# EAGLE design MotorController (EAGLE 5.04)
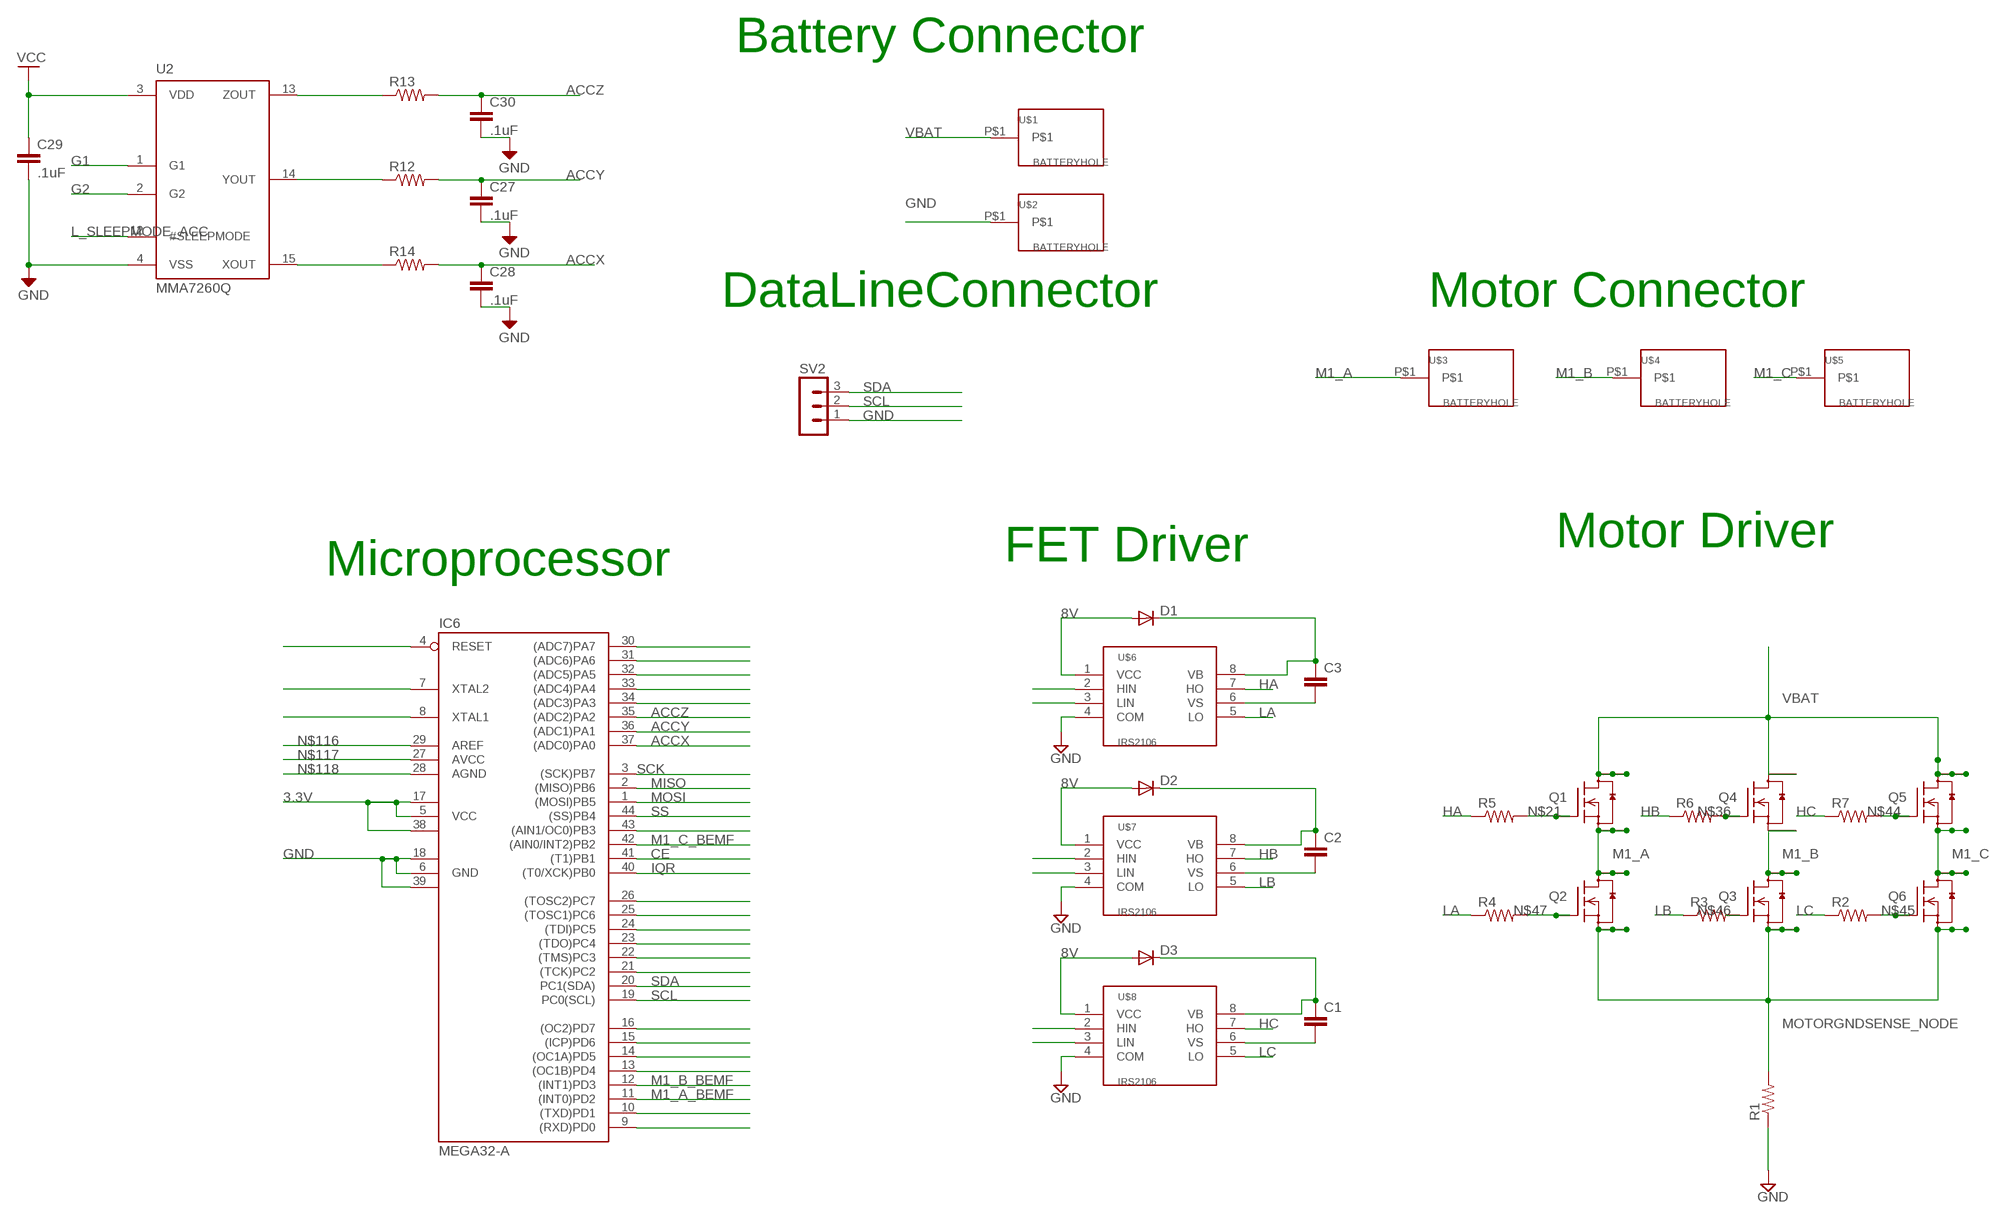
[diagram p0: schematic, sheet 1, part 1 of 2]
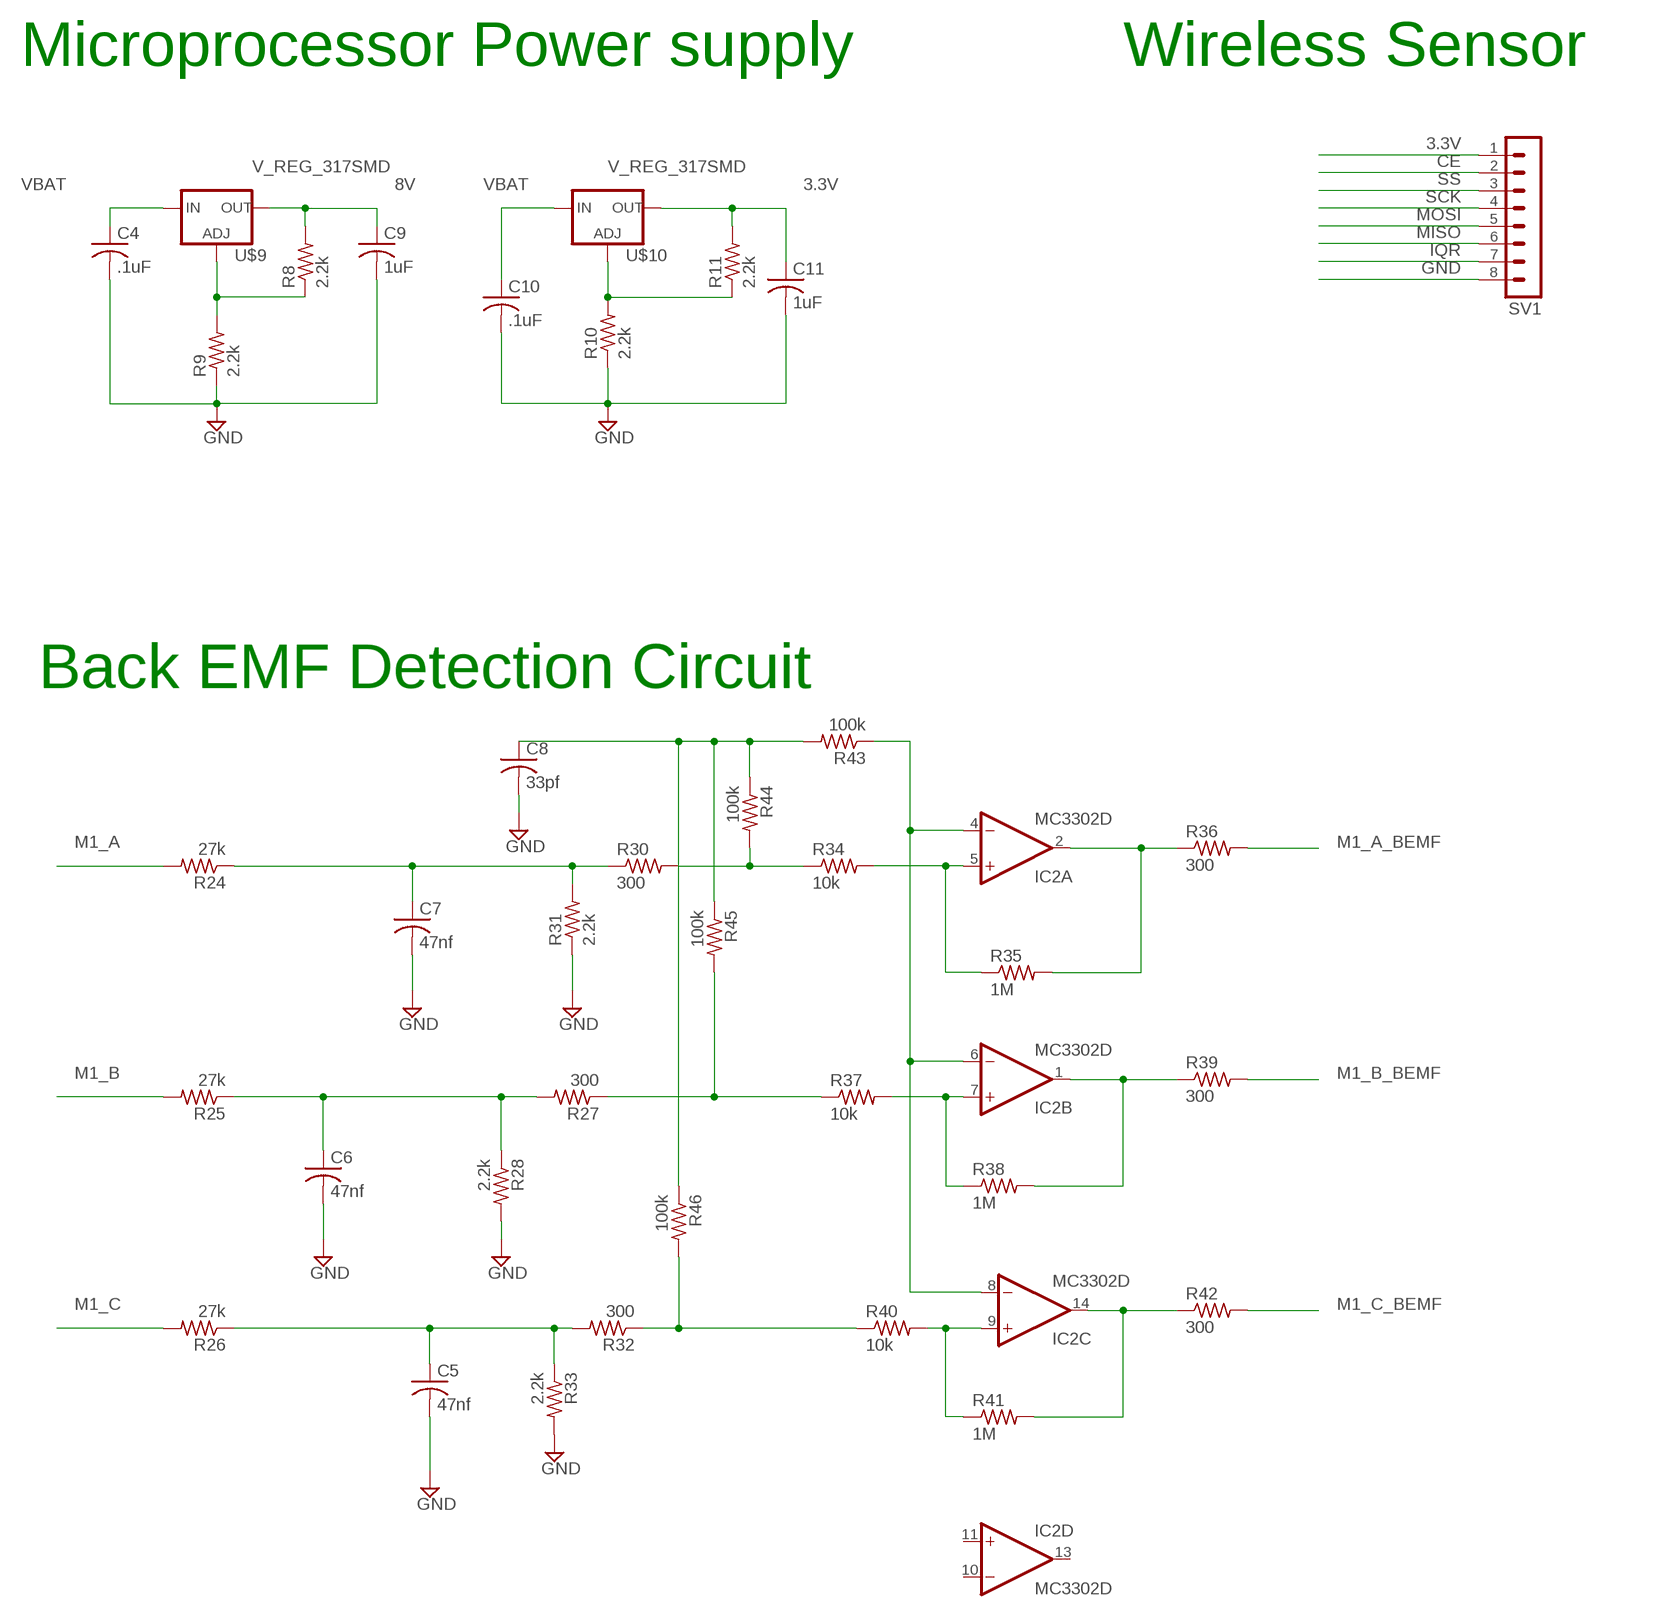
[diagram p1: schematic, sheet 1, part 2 of 2]

## Parts
C1  C-EUC0805  [C0805]
C2  C-EUC0805  [C0805]
C3  C-EUC0805  [C0805]
C4  .1uF  C-USC1206  [C1206@1]
C5  47nf  C-USC0603  [C0603@1]
C6  47nf  C-USC0603  [C0603@1]
C7  47nf  C-USC0603  [C0603@1]
C8  33pf  C-USC0603  [C0603@1]
C9  1uF  C-USC1206  [C1206@1]
C10  .1uF  C-USC1206  [C1206@1]
C11  1uF  C-USC1206  [C1206@1]
C27  .1uF  C-EUC0402  [C0402]
C28  .1uF  C-EUC0402  [C0402]
C29  .1uF  C-EUC0402  [C0402]
C30  .1uF  C-EUC0402  [C0402]
D1  DIODE-DO214AA  [DO214AA]
D2  DIODE-DO214AA  [DO214AA]
D3  DIODE-DO214AA  [DO214AA]
IC2  MC3302D  [SO14]
IC6  MEGA32-A  [TQFP44]
Q1  SI7868ADP  [SO-8-POWERPAK]
Q2  SI7868ADP  [SO-8-POWERPAK]
Q3  SI7868ADP  [SO-8-POWERPAK]
Q4  SI7868ADP  [SO-8-POWERPAK]
Q5  SI7868ADP  [SO-8-POWERPAK]
Q6  SI7868ADP  [SO-8-POWERPAK]
R1  R-US_R2512  [R2512]
R2  R-US_R1206  [R1206]
R3  R-US_R1206  [R1206]
R4  R-US_R1206  [R1206]
R5  R-US_R1206  [R1206]
R6  R-US_R1206  [R1206]
R7  R-US_R1206  [R1206]
R8  2.2k  R-US_R0603  [R0603]
R9  2.2k  R-US_R0603  [R0603]
R10  2.2k  R-US_R0603  [R0603]
R11  2.2k  R-US_R0603  [R0603]
R12  R-US_R0402  [R0402]
R13  R-US_R0402  [R0402]
R14  R-US_R0402  [R0402]
R24  27k  R-US_R0603  [R0603]
R25  27k  R-US_R0603  [R0603]
R26  27k  R-US_R0603  [R0603]
R27  300  R-US_R0603  [R0603]
R28  2.2k  R-US_R0603  [R0603]
R30  300  R-US_R0603  [R0603]
R31  2.2k  R-US_R0603  [R0603]
R32  300  R-US_R0603  [R0603]
R33  2.2k  R-US_R0603  [R0603]
R34  10k  R-US_R0603  [R0603]
R35  1M  R-US_R0603  [R0603]
R36  300  R-US_R0603  [R0603]
R37  10k  R-US_R0603  [R0603]
R38  1M  R-US_R0603  [R0603]
R39  300  R-US_R0603  [R0603]
R40  10k  R-US_R0603  [R0603]
R41  1M  R-US_R0603  [R0603]
R42  300  R-US_R0603  [R0603]
R43  100k  R-US_R0603  [R0603]
R44  100k  R-US_R0603  [R0603]
R45  100k  R-US_R0603  [R0603]
R46  100k  R-US_R0603  [R0603]
SV1  MA08-1  [MA08-1]
SV2  MA03-1  [MA03-1]
U2  MMA7260Q  [QFN-16]
U$1  BATTERYHOLE  [BATTERYHOLE]
U$2  BATTERYHOLE  [BATTERYHOLE]
U$3  BATTERYHOLE  [BATTERYHOLE]
U$4  BATTERYHOLE  [BATTERYHOLE]
U$5  BATTERYHOLE  [BATTERYHOLE]
U$6  IRS2106  [SOIC8]
U$7  IRS2106  [SOIC8]
U$8  IRS2106  [SOIC8]
U$9  V_REG_317SMD  [SOT223]
U$10  V_REG_317SMD  [SOT223]

## Nets
3.3V: C11.1 IC6.5(VCC) IC6.17(VCC1) IC6.38(VCC2) R11.2 SV1.1 U$10.2(OUT)
8V: C9.1 D1.A D2.A D3.A R8.2 U$6.1(VCC) U$7.1(VCC) U$8.1(VCC) U$9.2(OUT)
ACCX: C28.1 IC6.37((ADC0)PA0) R14.2
ACCY: C27.1 IC6.36((ADC1)PA1) R12.2
ACCZ: C30.1 IC6.35((ADC2)PA2) R13.2
CE: IC6.41((T1)PB1) SV1.2
G1: U2.1(G1)
G2: U2.2(G2)
GND: C4.2 C5.2 C6.2 C7.2 C8.2 C9.2 C10.2 C11.2 C27.2 C28.2 C29.2 C30.2 IC6.6(GND) IC6.18(GND1) IC6.39(GND2) R1.1 R9.1 R10.1 R28.2 R31.1 R33.2 SV1.8 SV2.1 U2.4(VSS) U$2.P$1 U$6.4(COM) U$7.4(COM) U$8.4(COM)
HA: R5.1 U$6.7(HO)
HB: R6.1 U$7.7(HO)
HC: R7.1 U$8.7(HO)
IQR: IC6.40((T0/XCK)PB0) SV1.7
L_SLEEPMODE_ACC: U2.12(#SLEEPMODE)
LA: R4.1 U$6.5(LO)
LB: R3.1 U$7.5(LO)
LC: R2.1 U$8.5(LO)
M1_A: Q1.1(S) Q1.2(S) Q1.3(S) Q2.6(D) Q2.7(D) Q2.8(D) R24.2 U$3.P$1
M1_A_BEMF: IC6.11((INT0)PD2) R36.2
M1_B: Q3.6(D) Q3.7(D) Q3.8(D) Q4.1(S) Q4.3(S) R25.2 U$4.P$1
M1_B_BEMF: IC6.12((INT1)PD3) R39.2
M1_C: Q5.1(S) Q5.2(S) Q5.3(S) Q6.6(D) Q6.7(D) Q6.8(D) R26.2 U$5.P$1
M1_C_BEMF: IC6.42((AIN0/INT2)PB2) R42.2
MISO: IC6.2((MISO)PB6) SV1.6
MOSI: IC6.1((MOSI)PB5) SV1.5
MOTORGNDSENSE_NODE: Q2.1(S) Q2.2(S) Q2.3(S) Q3.1(S) Q3.2(S) Q3.3(S) Q6.1(S) Q6.2(S) Q6.3(S) R1.2
N$1: C3.1 D1.C U$6.8(VB)
N$2: C3.2 U$6.6(VS)
N$5: C1.2 U$8.6(VS)
N$6: C6.1 R25.1 R27.2 R28.1
N$7: C1.1 D3.C U$8.8(VB)
N$8: C2.1 D2.C U$7.8(VB)
N$9: C2.2 U$7.6(VS)
N$10: R8.1 R9.2 U$9.1(ADJ)
N$11: U$8.2(HIN)
N$12: U$8.3(LIN)
N$13: U$7.2(HIN)
N$17: U$7.3(LIN)
N$18: U$6.2(HIN)
N$19: U$6.3(LIN)
N$21: Q1.4(G) R5.2
N$24: C7.1 R24.1 R30.1 R31.2
N$29: R30.2 R34.1 R44.2
N$30: IC2.4(A:-IN) IC2.6(B:-IN) IC2.8(C:-IN) R43.1
N$31: IC2.5(A:+IN) R34.2 R35.1
N$32: R10.2 R11.1 U$10.1(ADJ)
N$33: C8.1 R43.2 R44.1 R45.1 R46.1
N$34: IC2.7(B:+IN) R37.2 R38.1
N$35: R27.1 R37.1 R45.2
N$36: Q4.4(G) R6.2
N$37: IC2.9(C:+IN) R40.2 R41.1
N$38: R32.1 R40.1 R46.2
N$39: C5.1 R26.1 R32.2
N$40: R33.1
N$41: IC2.14(C:OUT) R41.2 R42.1
N$42: IC2.1(B:OUT) R38.2 R39.1
N$43: IC2.2(A:OUT) R35.2 R36.1
N$44: Q5.4(G) R7.2
N$45: Q6.4(G) R2.2
N$46: Q3.4(G) R3.2
N$47: Q2.4(G) R4.2
N$49: R13.1 U2.13(ZOUT)
N$50: R12.1 U2.14(YOUT)
N$51: R14.1 U2.15(XOUT)
N$113: IC6.4(RESET)
N$114: IC6.7(XTAL2)
N$115: IC6.8(XTAL1)
N$116: IC6.29(AREF)
N$117: IC6.27(AVCC)
N$118: IC6.28(AGND)
N$119: IC6.30((ADC7)PA7)
N$120: IC6.31((ADC6)PA6)
N$121: IC6.32((ADC5)PA5)
N$122: IC6.10((TXD)PD1)
N$123: IC6.9((RXD)PD0)
N$126: IC6.13((OC1B)PD4)
N$127: IC6.14((OC1A)PD5)
N$128: IC6.16((OC2)PD7)
N$129: IC6.15((ICP)PD6)
N$132: IC6.33((ADC4)PA4)
N$133: IC6.34((ADC3)PA3)
N$141: IC6.43((AIN1/OC0)PB3)
N$145: IC6.26((TOSC2)PC7)
N$146: IC6.25((TOSC1)PC6)
N$147: IC6.24((TDI)PC5)
N$148: IC6.23((TDO)PC4)
N$149: IC6.22((TMS)PC3)
N$150: IC6.21((TCK)PC2)
SCK: IC6.3((SCK)PB7) SV1.4
SCL: IC6.19(PC0(SCL)) SV2.2
SDA: IC6.20(PC1(SDA)) SV2.3
SS: IC6.44((SS)PB4) SV1.3
VBAT: C4.1 C10.1 Q1.6(D) Q1.7(D) Q1.8(D) Q4.6(D) Q4.8(D) Q5.6(D) Q5.7(D) Q5.8(D) U$1.P$1 U$9.3(IN) U$10.3(IN)
VCC: C29.1 U2.3(VDD)
Unconnected: IC2.10(D:-IN) IC2.11(D:+IN) IC2.13(D:OUT) Q1.5(D) Q2.5(D) Q3.5(D) Q4.2(S) Q4.5(D) Q4.7(D) Q5.5(D) Q6.5(D)

## Notes on the sheet
- Battery Connector | Microprocessor Power supply | Wireless Sensor
- DataLineConnector | Motor Connector
- FET Driver | Motor Driver | Back EMF Detection Circuit
- Microprocessor

## Power pins joined to a net without a drawn wire
V+: IC2.3(P:V+)
V-: IC2.12(P:V-)

## Library data of the parts
C1-C3 C27-C30 = rcl:C-EU: CAPACITOR, European symbol
C4-C11 = rcl:C-US: CAPACITOR, American symbol
D1-D3 = diode:DIODE-: DIODE
IC2 = linear:MC3302: COMPARATOR
IC6 = atmel:MEGA32: MICROCONTROLLER 32 Kbytes FLASH 2 Kbytes SRAM 1 Kbytes EEPROM USART 8-channel 10 bit ADC Source: www.atmel.com .. doc2503.pdf
Q1-Q6 = m-pad-2.1:SI7868ADP: Vishay Siliconix Si7868ADP N-Channel 20-V (D-S) MOSFET FEATURES TrenchFET Power MOSFET Low rDS(on) PWM (Qgd and Rg) Optimized 100% Rg Tested RoHS Compliant APPLICATIONS Low Output Voltage Synchronous Rectifier Please send any comments to: messi@users.sourceforge.net
R1-R14 R24-R28 R30-R46 = rcl:R-US_: RESISTOR, American symbol
SV1 = con-lstb:MA08-1: PIN HEADER
SV2 = con-lstb:MA03-1: PIN HEADER
U2 = m-pad-2.0:MMA7260Q: Freescale Semiconductor's MMA7260Q ±1.5g - 6g Three Axis Low-g Micromachined Accelerometer Description: The MMA7260Q low cost capacitive micromachined accelerometer features signal conditioning, a 1-pole low pass filter, temperature compensation and g-Select which allows for the selection among 4 sensitivities. Zero-g offset full scale span and filter cut-off are factory set and require no external devices. Includes a Sleep Mode that makes it ideal for handheld battery powered electronics. Features: Selectable Sensitivity (1.5g/2g/4g/6g) Low Current Consumption: 500 µA Sleep Mode: 3 µA Low Voltage Operation: 2.2 V  3.6 V 6mm x 6mm x 1.45mm QFN High Sensitivity (800 mV/g @1.5 g) Fast Turn On Time High Sensitivity (1.5 g) Integral Signal Conditioning with Low Pass Filter Robust Design, High Shocks Survivability Pb-Free Terminations Environmentally Preferred Package Low Cost Typical Applications: HDD MP3 Player : Freefall Detection Laptop PC : Freefall Detection, Anti-Theft Cell Phone : Image Stability, Text Scroll, Motion Dialing, E-Compass Pedometer : Motion Sensing PDA : Text Scroll Navigation and Dead Reckoning : E-Compass Tilt Compensation Gaming : Tilt and Motion Sensing, Event Recorder Robotics : Motion Sensing Please send any comments to: messi@users.sourceforge.net
U$1-U$5 = m-pad-2.1:BATTERYHOLE
U$6-U$8 = m-pad-2.1:IRS2106
U$9 U$10 = SparkFun:V_REG_317: Voltage Regulator Standard LM317 adjustable voltage regulator. AOI (Adjust Output Input). Google 'LM317 Calculator' for easy to use app to get the two resistor values needed. 240/720 for 5V output. 240/390 for 3.3V output. Spark Fun Electronics SKU : COM-00527

## Board
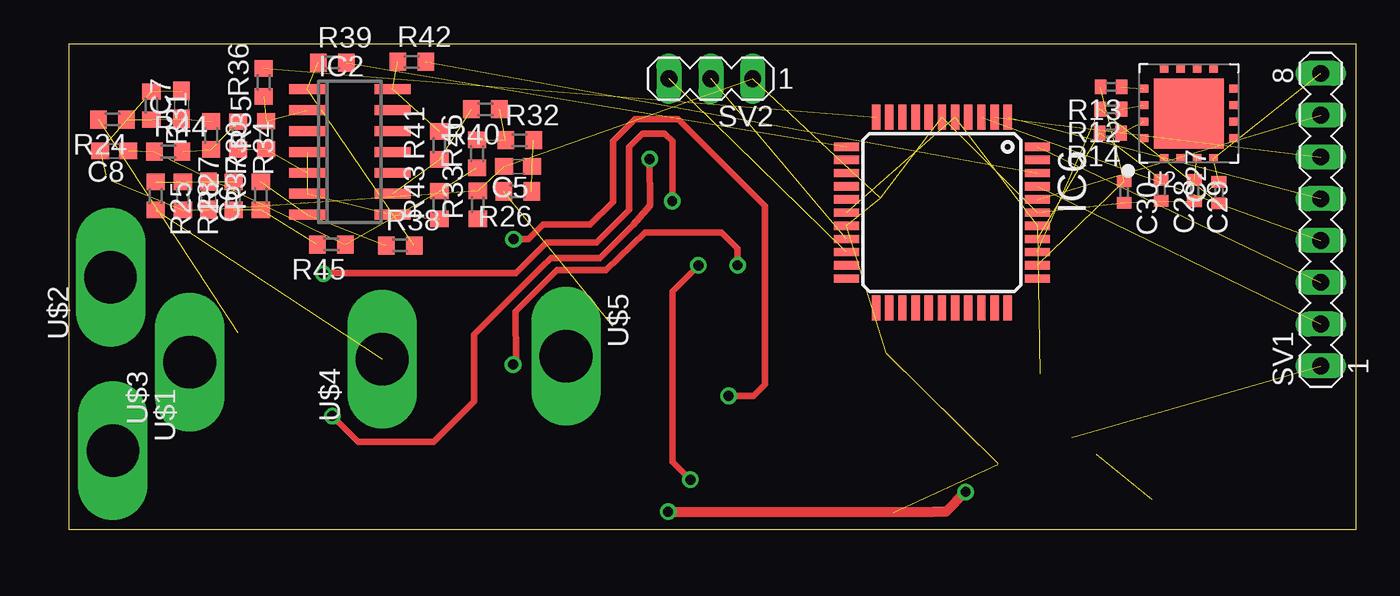
[diagram p2: board, top side]
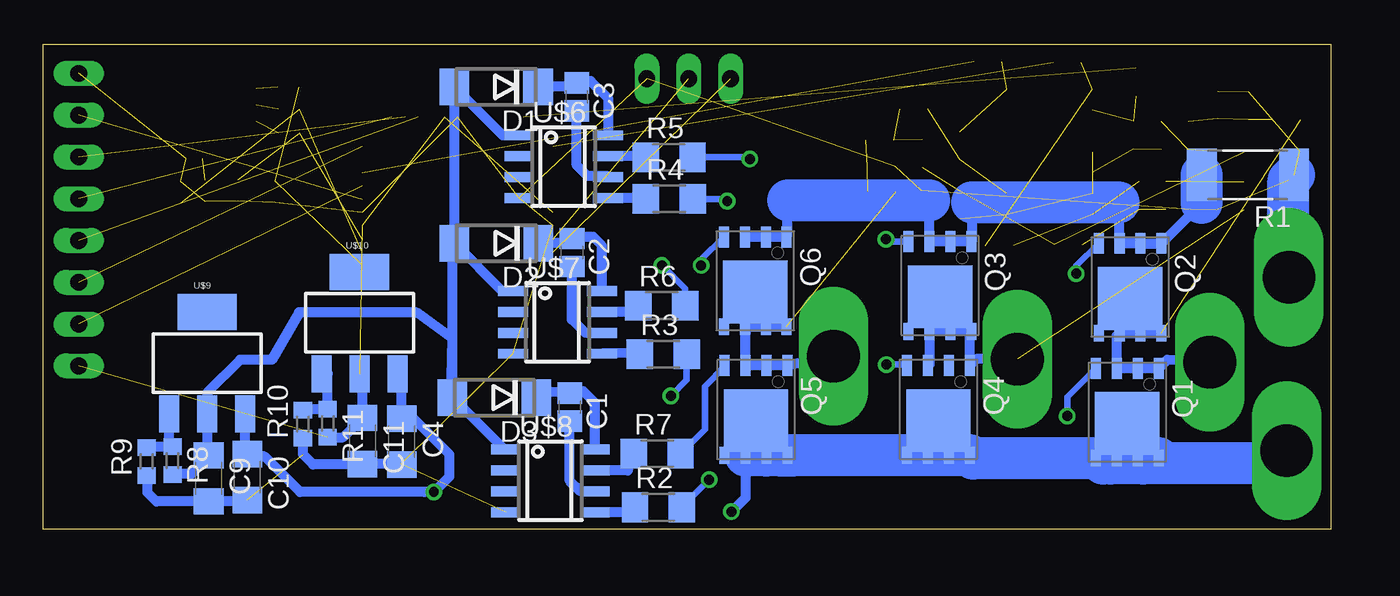
[diagram p3: board, bottom side, seen from below]

Size 78.22 x 29.5 mm. Coordinates in mm from the lower left corner, seen from the top.
Outline: 0,0 78.22,0 78.22,29.5 0,29.5 0,0
Copper layers (1*16): Top 0.035mm / dielectric 1.5mm / Bottom 0.035mm
Design rules "default *": minimum track width 10mil, minimum drill 24mil, track to track 8mil, track to pad 8mil, pad to pad 8mil, via to via 8mil, smd to smd 8mil, copper to edge 10mil, drill to drill 8mil, minimum pad ring 10mil, minimum via ring 8mil, stop-mask expansion 4mil, vias tented up to drill 0mil, thermal gap 10mil

### Footprints (pad centres in the part's own frame; a part is rotated, then mirrored left to right if it is on the bottom)
C0805 = smd 1.3 x 1.5: 1 -0.85,0; 2 0.85,0
C1206@1 = smd 1.6 x 1.8: 1 -1.4,0; 2 1.4,0
C0603@1 = smd 1.1 x 1: 1 -0.85,0; 2 0.85,0
C0402 = smd 0.7 x 0.9: 1 -0.65,0; 2 0.65,0
DO214AA = smd 1.8 x 2.2: A 2.55,0; C -2.55,0
SO14 = smd 0.6 x 2.2: 1 -3.81,-2.6; 2 -2.54,-2.6; 3 -1.27,-2.6; 4 0,-2.6; 5 1.27,-2.6; 6 2.54,-2.6; 7 3.81,-2.6; 8 3.81,2.6; 9 2.54,2.6; 10 1.27,2.6; 11 0,2.6; 12 -1.27,2.6; 13 -2.54,2.6; 14 -3.81,2.6
TQFP44 = smd 1.5 x 0.5: 1 -5.8,4; 2 -5.8,3.2; 3 -5.8,2.4; 4 -5.8,1.6; 5 -5.8,0.8; 6 -5.8,0; 7 -5.8,-0.8; 8 -5.8,-1.6; 9 -5.8,-2.4; 10 -5.8,-3.2; 11 -5.8,-4; 23 5.8,-4; 24 5.8,-3.2; 25 5.8,-2.4; 26 5.8,-1.6; 27 5.8,-0.8; 28 5.8,0; 29 5.8,0.8; 30 5.8,1.6; 31 5.8,2.4; 32 5.8,3.2; 33 5.8,4 | smd 0.5 x 1.5: 12 -4,-5.8; 13 -3.2,-5.8; 14 -2.4,-5.8; 15 -1.6,-5.8; 16 -0.8,-5.8; 17 0,-5.8; 18 0.8,-5.8; 19 1.6,-5.8; 20 2.4,-5.8; 21 3.2,-5.8; 22 4,-5.8; 34 4,5.8; 35 3.2,5.8; 36 2.4,5.8; 37 1.6,5.8; 38 0.8,5.8; 39 0,5.8; 40 -0.8,5.8; 41 -1.6,5.8; 42 -2.4,5.8; 43 -3.2,5.8; 44 -4,5.8
SO-8-POWERPAK = smd 1.27 x 0.61: 1 -2.667,2.54; 2 -2.667,1.27; 3 -2.667,0; 4 -2.667,-1.27 | smd 1.016 x 0.61: 5 2.794,-1.27; 6 2.794,0; 7 2.794,1.27; 8 2.794,2.54 | smd 3.81 x 3.912: P$1 0.686,0.635
R2512 = smd 1.8 x 3.2: 1 -2.8,0; 2 2.8,0
R1206 = smd 1.6 x 1.803: 1 -1.422,0; 2 1.422,0
R0603 = smd 1 x 1.1: 1 -0.85,0; 2 0.85,0
R0402 = smd 0.7 x 0.9: 1 -0.65,0; 2 0.65,0
MA08-1 = drill 1.016 long: 1 -8.89,0; 2 -6.35,0; 3 -3.81,0; 4 -1.27,0; 5 1.27,0; 6 3.81,0; 7 6.35,0; 8 8.89,0
MA03-1 = drill 1.016 long: 1 -2.54,0; 2 0,0; 3 2.54,0
QFN-16 = smd 0.5 x 0.55: 1 -1.5,-2.75; 2 -0.5,-2.75; 3 0.5,-2.75; 4 1.5,-2.75; 9 1.5,2.75; 10 0.5,2.75; 11 -0.5,2.75; 12 -1.5,2.75 | smd 0.55 x 0.5: 5 2.75,-1.5; 6 2.75,-0.5; 7 2.75,0.5; 8 2.75,1.5; 13 -2.75,1.5; 14 -2.75,0.5; 15 -2.75,-0.5; 16 -2.75,-1.5 | smd 4.25 x 4.25: P$1 0,0
BATTERYHOLE = drill 3.2 long: P$1 0,0
SOIC8 = smd 0.6 x 1.8: 1 -1.905,-2.7; 2 -0.635,-2.7; 3 0.635,-2.7; 4 1.905,-2.7; 5 1.905,2.7; 6 0.635,2.7; 7 -0.635,2.7; 8 -1.905,2.7
SOT223 = smd 1.219 x 2.235: 1 -2.311,-3.099; 2 0,-3.099; 3 2.311,-3.099 | smd 3.6 x 2.2: 4 0,3.099

### Placement (x,y rotation side)
C1  46.24,7.45 270 bottom
C2  46.1,16.84 270 bottom
C3  45.81,26.31 270 bottom
C4  56.45,5.35 270 bottom
C5  27.31,22.07 180 top
C6  8.49,20.3 270 top
C7  6.85,25.81 90 top
C8  2.75,23.02 180 top
C9  68.18,3.11 270 bottom
C10  65.83,3.19 270 bottom
C11  58.83,5.38 270 bottom
C27  69.88,20.49 90 top
C28  66.37,20.62 270 top
C29  68.4,20.6 270 top
C30  64.13,20.52 270 top
D1  50.71,26.91 180 bottom
D2  50.69,17.4 180 bottom
D3  50.82,8.02 180 bottom
IC2  17.08,22.95 270 top
IC6  53.05,19.27 270 top
Q1  12.99,7.13 270 bottom
Q2  12.83,14.73 270 bottom
Q3  24.38,14.83 270 bottom
Q4  24.47,7.3 270 bottom
Q5  35.55,7.3 270 bottom
Q6  35.6,15.12 270 bottom
R1  5.03,21.55 180 bottom
R2  40.85,1.35 0 bottom
R3  40.55,10.66 0 bottom
R4  40.19,20.1 0 bottom
R5  40.2,22.63 0 bottom
R6  40.64,13.61 0 bottom
R7  40.92,4.61 0 bottom
R8  70.37,4.18 270 bottom
R9  71.94,4.14 90 bottom
R10  62.45,6.41 90 bottom
R11  60.94,6.45 270 bottom
R12  63.31,25.55 180 top
R13  63.33,26.9 180 top
R14  63.29,24.09 180 top
R24  2.66,24.93 180 top
R25  5.28,20.28 270 top
R26  27.27,20.56 180 top
R27  10.03,20.29 90 top
R28  6.94,20.28 270 top
R30  8.65,23.95 270 top
R31  5.02,25.77 270 top
R32  27.4,23.66 0 top
R33  24.85,19.74 90 top
R34  10.3,23.94 270 top
R35  11.99,23.97 90 top
R36  11.84,27.18 90 top
R37  11.67,20.29 90 top
R38  20.14,17.27 0 top
R39  16.01,28.39 0 top
R40  25.32,25.54 180 top
R41  22.52,23.35 90 top
R42  20.83,28.43 0 top
R43  22.52,19.72 90 top
R44  6.04,22.98 0 top
R45  15.95,17.33 180 top
R46  24.81,22.84 90 top
SV1  76.07,18.84 90 top
SV2  39.01,27.4 180 top
U2  68.06,25.29 0 top
U$1  2.68,4.8 270 top
U$2  2.54,15.34 90 top
U$3  7.34,10.18 90 top
U$4  19.04,10.36 90 top
U$5  30.21,10.54 270 top
U$6  46.61,22.06 270 bottom
U$7  46.98,12.59 270 bottom
U$8  47.41,2.96 270 bottom
U$9  68.26,10.12 0 bottom
U$10  59.01,12.56 0 bottom

### Tracks (layer width: path | path; a pad name or v marks a point on that pad's centre or on a via)
3.3V  (4 unrouted)
  Bottom 0.61: U$10.2 58.83,9.46 C11.1 60.01,5.6 R11.2
8V
  Bottom 0.61: U$6.1 50.32,23.96 D1.A 53.24,26.89 D2.A | U$7.1 50.34,14.5 D2.A | U$8.1 50.21,4.86 D3.A | R8.2 70.33,3.38 69.22,3.38 68.18,4.42 C9.1 68.26,4.59 U$9.2 68.26,8.32 66.27,10.32 64.35,10.32 62.69,13.2 55.52,13.19 53.36,11.62 53.45,8.1 D3.A | D3.A 53.37,17.28 D2.A
ACCX  (2 unrouted)
ACCY  (2 unrouted)
ACCZ  (2 unrouted)
CE  (1 unrouted)
GND  (22 unrouted)
  Bottom 0.61: R10.1 62.45,4.57 61.83,3.96 58.86,3.96 C11.2 56.48,3.98 C4.2 | R9.1 71.89,3.24 71.89,2.24 71.35,1.71 C9.2 65.92,1.71 C10.2
  Bottom 2.54: U$2.P$1 2.57,21.22 R1.1
HA
  Bottom 0.61: U$6.7 41.3,22.69 R5.1
HB
  Bottom 0.61: U$7.7 41.89,13.23 R6.1
HC
  Bottom 0.61: U$8.7 42.72,3.6 R7.1
IQR  (1 unrouted)
LA
  Bottom 0.61: U$6.5 41.34,20.15 R4.1
LB
  Bottom 0.61: U$7.5 42.19,10.74 R3.1
LC
  Bottom 0.61: U$8.5 41.96,1.05 R2.1
M1_A  (1 unrouted)
  Bottom 0.61: U$3.P$1 9.94,10.32 Q1.1 Q1.2 Q1.3 12.99,11.77 Q2.6 Q2.7 Q2.8
M1_A_BEMF  (1 unrouted)
M1_B  (1 unrouted)
  Bottom 0.61: Q4.3 24.38,10.06 Q3.6 Q3.7 Q3.8 21.93,11.95 Q4.1 21.54,10.36 U$4.P$1
M1_B_BEMF  (1 unrouted)
M1_C  (1 unrouted)
  Bottom 0.61: U$5.P$1 32.11,10.17 Q5.1 Q5.2 Q5.3 35.55,11.94 Q6.6 Q6.7 Q6.8
M1_C_BEMF  (1 unrouted)
MISO  (1 unrouted)
MOSI  (1 unrouted)
MOTORGNDSENSE_NODE
  Bottom 0.61: 7.83,19.85 Q2.1 Q2.2 Q2.3 12.83,19.93 12.88,19.89 | 21.8,19.89 21.8,17.54 Q3.1 Q3.2 Q3.3 24.38,19.99 24.39,20 | 32.97,20 33.04,19.93 33.04,17.81 Q6.1 Q6.2 Q6.3
  Bottom 2.54: 7.83,19.85 R1.2 | 12.88,19.89 21.8,19.89 | 24.39,20 32.97,20
N$1
  Bottom 0.61: U$6.8 43.89,23.98 43.89,26.19 44.97,27.26 C3.1 46.16,26.91 D1.C
N$2
  Bottom 0.61: C3.2 45.81,22.14 45.15,21.49 43.98,21.49 U$6.6
N$5
  Bottom 0.61: C1.2 46.24,2.96 45.6,2.32 U$8.6
N$6  (3 unrouted)
N$7
  Bottom 0.61: U$8.8 44.71,7.71 45.4,8.4 46.23,8.4 C1.1 47.89,8.4 D3.C
N$8
  Bottom 0.61: U$7.8 44.28,17.25 44.81,17.78 46.09,17.78 C2.1 46.49,17.4 D2.C
N$9
  Bottom 0.61: C2.2 46.1,12.76 45.29,11.95 U$7.6
N$10
  Bottom 0.61: U$9.1 70.57,5.23 R8.1 71.89,5.03 R9.2
N$21  (via drill 0.6)
  Top 0.406: v35.29,22.53 35.31,19.68 34.28,18.52 32.27,16.5 29.3,16.5 28.79,16.01 24.63,11.86 24.63,7.8 22.15,5.32 17.58,5.32 v16,6.9
  Bottom 0.406: R5.2 35.39,22.63 v35.29,22.53 | v16,6.9 16,8.06 Q1.4
N$24  (3 unrouted)
N$29  (2 unrouted)
N$30  (3 unrouted)
N$31  (2 unrouted)
N$32
  Bottom 0.61: U$10.1 60.94,9.46 R11.1 62.45,7.3 R10.2
N$33  (4 unrouted)
N$34  (2 unrouted)
N$35  (2 unrouted)
N$36  (via drill 0.6)
  Top 0.406: v40.63,16.07 40.63,17.09 39.66,18.06 35.02,18.06 32.66,15.76 29.67,15.76 27.16,13.25 27.18,10.21 v27,10.03
  Bottom 0.406: R6.2 39.22,14.65 v40.63,16.07 | v27,10.03 25.8,10.03 Q4.4
N$37  (2 unrouted)
N$38  (2 unrouted)
N$39  (2 unrouted)
N$41  (2 unrouted)
N$42  (2 unrouted)
N$43  (2 unrouted)
N$44
  Bottom 0.406: Q5.4 36.82,9.91 38.03,8.7 38.03,6.08 R7.2
N$45  (via drill 0.6)
  Top 0.406: v38.25,16.05 36.68,14.47 36.68,4.13 v37.77,3.03
  Bottom 0.406: 39.22,1.13 39.43,1.34 R2.2 37.77,3.01 v37.77,3.03 | v38.25,16.05 38.25,16.4 Q6.4
N$46  (via drill 0.6)
  Top 0.406: v40.09,8.12 41.6,8.12 42.31,8.83 42.31,19.66 37.03,24.95 34.39,24.95 33.07,23.62 33.07,19.92 31.68,18.53 28.82,18.53 27.94,17.65 v27.03,17.65
  Bottom 0.406: R3.2 39.13,9.08 v40.09,8.12 | Q3.4 26.87,17.5 v27.03,17.65
N$47  (via drill 0.6)
  Top 0.406: v36.67,19.96 36.67,23.6 36.21,24.07 34.85,24.07 34.04,23.25 34.04,19.42 32.07,17.45 29.02,17.45 27.16,15.59 15.49,15.59 v15.46,15.55
  Bottom 0.406: R4.2 36.8,20.1 v36.67,19.96 | v15.46,15.55 15.46,16.04 Q2.4
N$49  (1 unrouted)
N$50  (1 unrouted)
N$51  (1 unrouted)
SCK  (1 unrouted)
SCL  (1 unrouted)
SDA  (1 unrouted)
SS  (1 unrouted)
VBAT  (via drill 0.6)
  Top 0.61: v36.41,1.08 52.55,1.08 52.57,1.1 53.32,1.1 v54.49,2.28
  Bottom 0.61: U$10.3 56.45,9.46 C4.1 55.74,6.75 53.55,4.56 53.55,3.22 v54.49,2.28 55.06,2.28 62.63,2.28 64.78,4.44 65.68,4.44 C10.1 65.95,4.71 U$9.3 | Q5.6 35.55,1.94 v36.41,1.08
  Bottom 2.54: U$1.P$1 3.11,4.8 3.9,4.01 11.4,4.01 | 11.4,4.01 Q1.7 Q1.8 | 11.4,4.01 13.84,4.01 13.96,4.13 | 13.96,4.13 | 13.96,4.13 13.59,4.13 | 13.96,4.13 14.15,4.32 21.74,4.32 Q4.8 Q4.6 25.69,4.51 25.7,4.51 33.58,4.51 | 11.4,4.01 13.38,4.01 13.5,4.13 13.5,4.04 13.29,4.04 Q1.6 | 33.58,4.51 Q5.7 Q5.6 | 33.58,4.51 32.54,4.51 Q5.8
VCC  (1 unrouted)